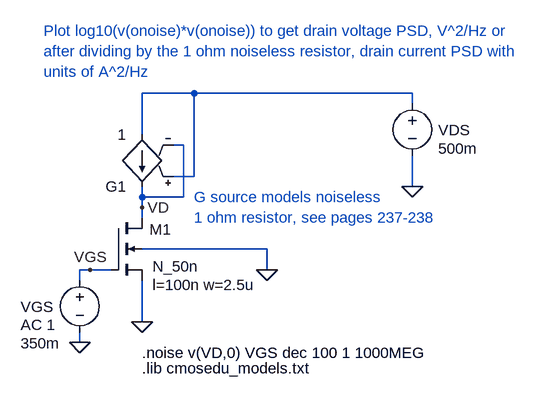
[diagram p0: schematic NOISE_NMOS_50n.asc]
NOISE_NMOS_50n.asc, the LTspice schematic file:
Version 4
SHEET 1 1180 680
WIRE 528 -80 448 -80
WIRE 864 -80 528 -80
WIRE 864 -64 864 -80
WIRE 448 -16 448 -80
WIRE 512 0 496 0
WIRE 528 48 528 -80
WIRE 528 48 496 48
WIRE 864 64 864 16
WIRE 448 80 448 64
WIRE 512 80 512 0
WIRE 512 80 448 80
WIRE 448 96 448 80
WIRE 448 112 448 96
WIRE 640 160 448 160
WIRE 368 192 352 192
WIRE 400 192 368 192
WIRE 640 192 640 160
WIRE 352 208 352 192
WIRE 448 272 448 208
WIRE 352 304 352 288
FLAG 352 304 0
FLAG 448 272 0
FLAG 640 192 0
FLAG 448 96 VD
FLAG 368 192 VGS
FLAG 864 64 0
SYMBOL nmos4 400 112 R0
WINDOW 0 59 18 Left 0
WINDOW 3 64 75 Left 0
WINDOW 123 64 103 Left 0
SYMATTR InstName M1
SYMATTR Value N_50n
SYMATTR Value2 l=100n w=2.5u
SYMBOL voltage 352 192 R0
WINDOW 0 -91 57 Left 0
WINDOW 3 -91 113 Left 0
WINDOW 123 -91 85 Left 0
WINDOW 39 0 0 Left 0
SYMATTR InstName VGS
SYMATTR Value 350m
SYMATTR Value2 AC 1
SYMBOL voltage 864 -80 R0
WINDOW 123 0 0 Left 0
WINDOW 39 0 0 Left 0
WINDOW 0 40 57 Left 0
WINDOW 3 40 85 Left 0
SYMATTR InstName VDS
SYMATTR Value 500m
SYMBOL g 448 80 R180
SYMATTR InstName G1
SYMATTR Value 1
TEXT 448 320 Left 0 !.noise v(VD,0) VGS dec 100 1 1000MEG
TEXT 448 344 Left 0 !.lib cmosedu_models.txt
TEXT 296 -176 Left 0 ;Plot log10(v(onoise)*v(onoise)) to get drain voltage PSD, V^2/Hz or \nafter dividing by the 1 ohm noiseless resistor, drain current PSD with\nunits of A^2/Hz
TEXT 528 80 Left 0 ;G source models noiseless\n1 ohm resistor, see pages 237-238

The netlist it stands for:
* NOISE_NMOS_50n.asc
M1 VD VGS 0 0 N_50n l=100n w=2.5u
VGS VGS 0 350m AC 1
VDS N001 0 500m
G1 N001 VD N001 VD 1
.model NMOS NMOS
.model PMOS PMOS
.lib standard.mos
.noise v(VD,0) VGS dec 100 1 1000MEG
.lib cmosedu_models.txt
* Plot log10(v(onoise)*v(onoise)) to get drain voltage PSD, V^2/Hz or
* after dividing by the 1 ohm noiseless resistor, drain current PSD with
* units of A^2/Hz
* G source models noiseless
* 1 ohm resistor, see pages 237-238
.backanno
.end